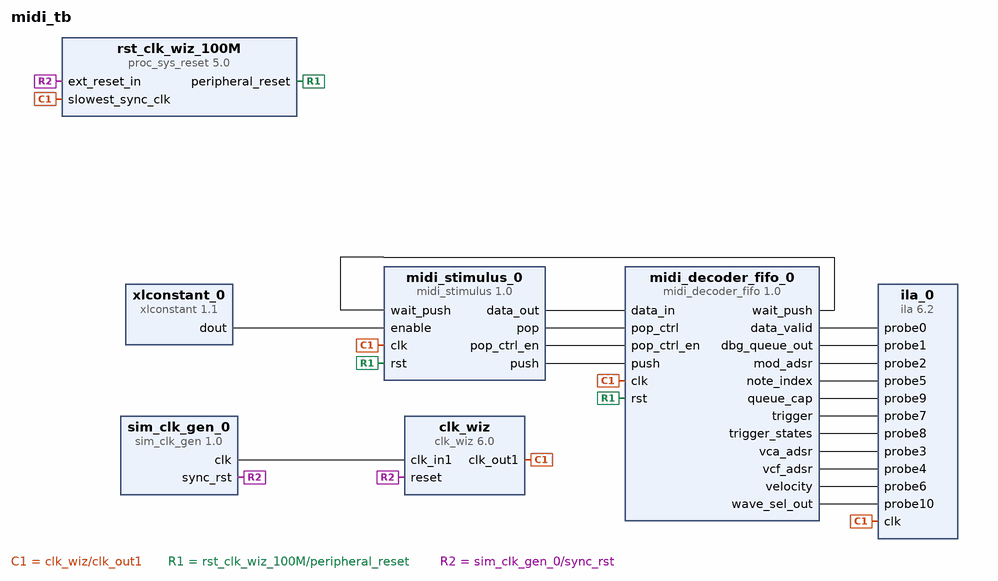
[diagram p0: block diagram of the top level]
# Vivado block design midi_tb, xc7z020clg400-1, Vivado 2021.1
create_bd_design midi_tb

create_bd_cell -type ip -vlnv xilinx.com:ip:proc_sys_reset:5.0 rst_clk_wiz_100M
create_bd_cell -type ip -vlnv xilinx.com:ip:ila:6.2 ila_0
set_property -dict [list \
  CONFIG.C_ENABLE_ILA_AXI_MON false \
  CONFIG.C_MONITOR_TYPE Native \
  CONFIG.C_NUM_OF_PROBES 11 \
  CONFIG.C_PROBE10_WIDTH 2 \
  CONFIG.C_PROBE11_WIDTH 1 \
  CONFIG.C_PROBE1_WIDTH 16 \
  CONFIG.C_PROBE2_WIDTH 28 \
  CONFIG.C_PROBE3_WIDTH 28 \
  CONFIG.C_PROBE4_WIDTH 28 \
  CONFIG.C_PROBE5_WIDTH 7 \
  CONFIG.C_PROBE6_WIDTH 7 \
  CONFIG.C_PROBE7_WIDTH 1 \
  CONFIG.C_PROBE8_WIDTH 1 \
  CONFIG.C_PROBE9_WIDTH 5 \
] [get_bd_cells ila_0]
create_bd_cell -type ip -vlnv xilinx.com:ip:clk_wiz:6.0 clk_wiz
create_bd_cell -type ip -vlnv xilinx.com:user:midi_stimulus:1.0 midi_stimulus_0
create_bd_cell -type ip -vlnv xilinx.com:ip:sim_clk_gen:1.0 sim_clk_gen_0
set_property -dict {CONFIG.RESET_POLARITY ACTIVE_HIGH} [get_bd_cells sim_clk_gen_0]
create_bd_cell -type ip -vlnv xilinx.com:ip:xlconstant:1.1 xlconstant_0
create_bd_cell -type ip -vlnv xilinx.com:user:midi_decoder_fifo:1.0 midi_decoder_fifo_0

# ---- connections ----

connect_bd_net [get_bd_pins clk_wiz/clk_out1] \
  [get_bd_pins rst_clk_wiz_100M/slowest_sync_clk] [get_bd_pins ila_0/clk] [get_bd_pins midi_stimulus_0/clk] \
  [get_bd_pins midi_decoder_fifo_0/clk]
connect_bd_net [get_bd_pins midi_decoder_fifo_0/data_valid] [get_bd_pins ila_0/probe0]
connect_bd_net [get_bd_pins midi_decoder_fifo_0/dbg_queue_out] [get_bd_pins ila_0/probe1]
connect_bd_net [get_bd_pins midi_decoder_fifo_0/mod_adsr] [get_bd_pins ila_0/probe2]
connect_bd_net [get_bd_pins midi_decoder_fifo_0/note_index] [get_bd_pins ila_0/probe5]
connect_bd_net [get_bd_pins midi_decoder_fifo_0/queue_cap] [get_bd_pins ila_0/probe9]
connect_bd_net [get_bd_pins midi_decoder_fifo_0/trigger] [get_bd_pins ila_0/probe7]
connect_bd_net [get_bd_pins midi_decoder_fifo_0/trigger_states] [get_bd_pins ila_0/probe8]
connect_bd_net [get_bd_pins midi_decoder_fifo_0/vca_adsr] [get_bd_pins ila_0/probe3]
connect_bd_net [get_bd_pins midi_decoder_fifo_0/vcf_adsr] [get_bd_pins ila_0/probe4]
connect_bd_net [get_bd_pins midi_decoder_fifo_0/velocity] [get_bd_pins ila_0/probe6]
connect_bd_net [get_bd_pins midi_decoder_fifo_0/wait_push] [get_bd_pins midi_stimulus_0/wait_push]
connect_bd_net [get_bd_pins midi_decoder_fifo_0/wave_sel_out] [get_bd_pins ila_0/probe10]
connect_bd_net [get_bd_pins midi_stimulus_0/data_out] [get_bd_pins midi_decoder_fifo_0/data_in]
connect_bd_net [get_bd_pins midi_stimulus_0/pop] [get_bd_pins midi_decoder_fifo_0/pop_ctrl]
connect_bd_net [get_bd_pins midi_stimulus_0/pop_ctrl_en] [get_bd_pins midi_decoder_fifo_0/pop_ctrl_en]
connect_bd_net [get_bd_pins midi_stimulus_0/push] [get_bd_pins midi_decoder_fifo_0/push]
connect_bd_net [get_bd_pins rst_clk_wiz_100M/peripheral_reset] [get_bd_pins midi_stimulus_0/rst] [get_bd_pins midi_decoder_fifo_0/rst]
connect_bd_net [get_bd_pins sim_clk_gen_0/clk] [get_bd_pins clk_wiz/clk_in1]
connect_bd_net [get_bd_pins sim_clk_gen_0/sync_rst] [get_bd_pins clk_wiz/reset] [get_bd_pins rst_clk_wiz_100M/ext_reset_in]
connect_bd_net [get_bd_pins xlconstant_0/dout] [get_bd_pins midi_stimulus_0/enable]
set_property PFM.CLOCK {clk_out1 {id "2" is_default "false" proc_sys_reset "/rst_clk_wiz_100M" status "fixed" freq_hz "100000000"}} [get_bd_cells clk_wiz]

validate_bd_design
save_bd_design
